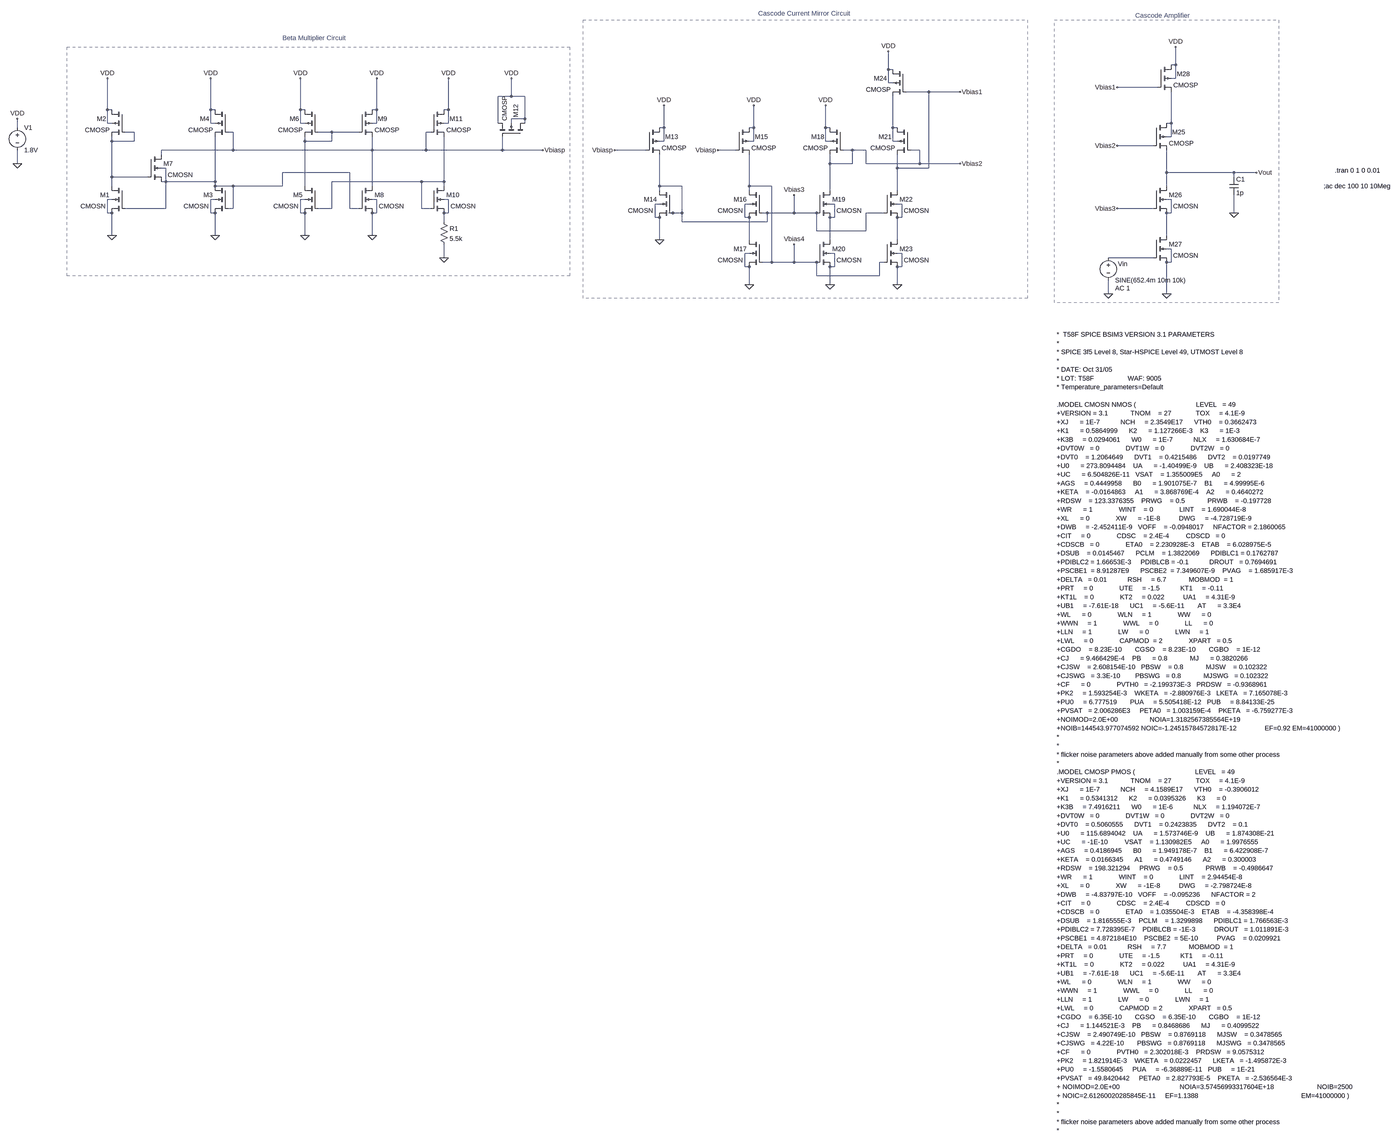
[diagram p0: schematic Rohan Nijhawan_180nm.asc, whole sheet]
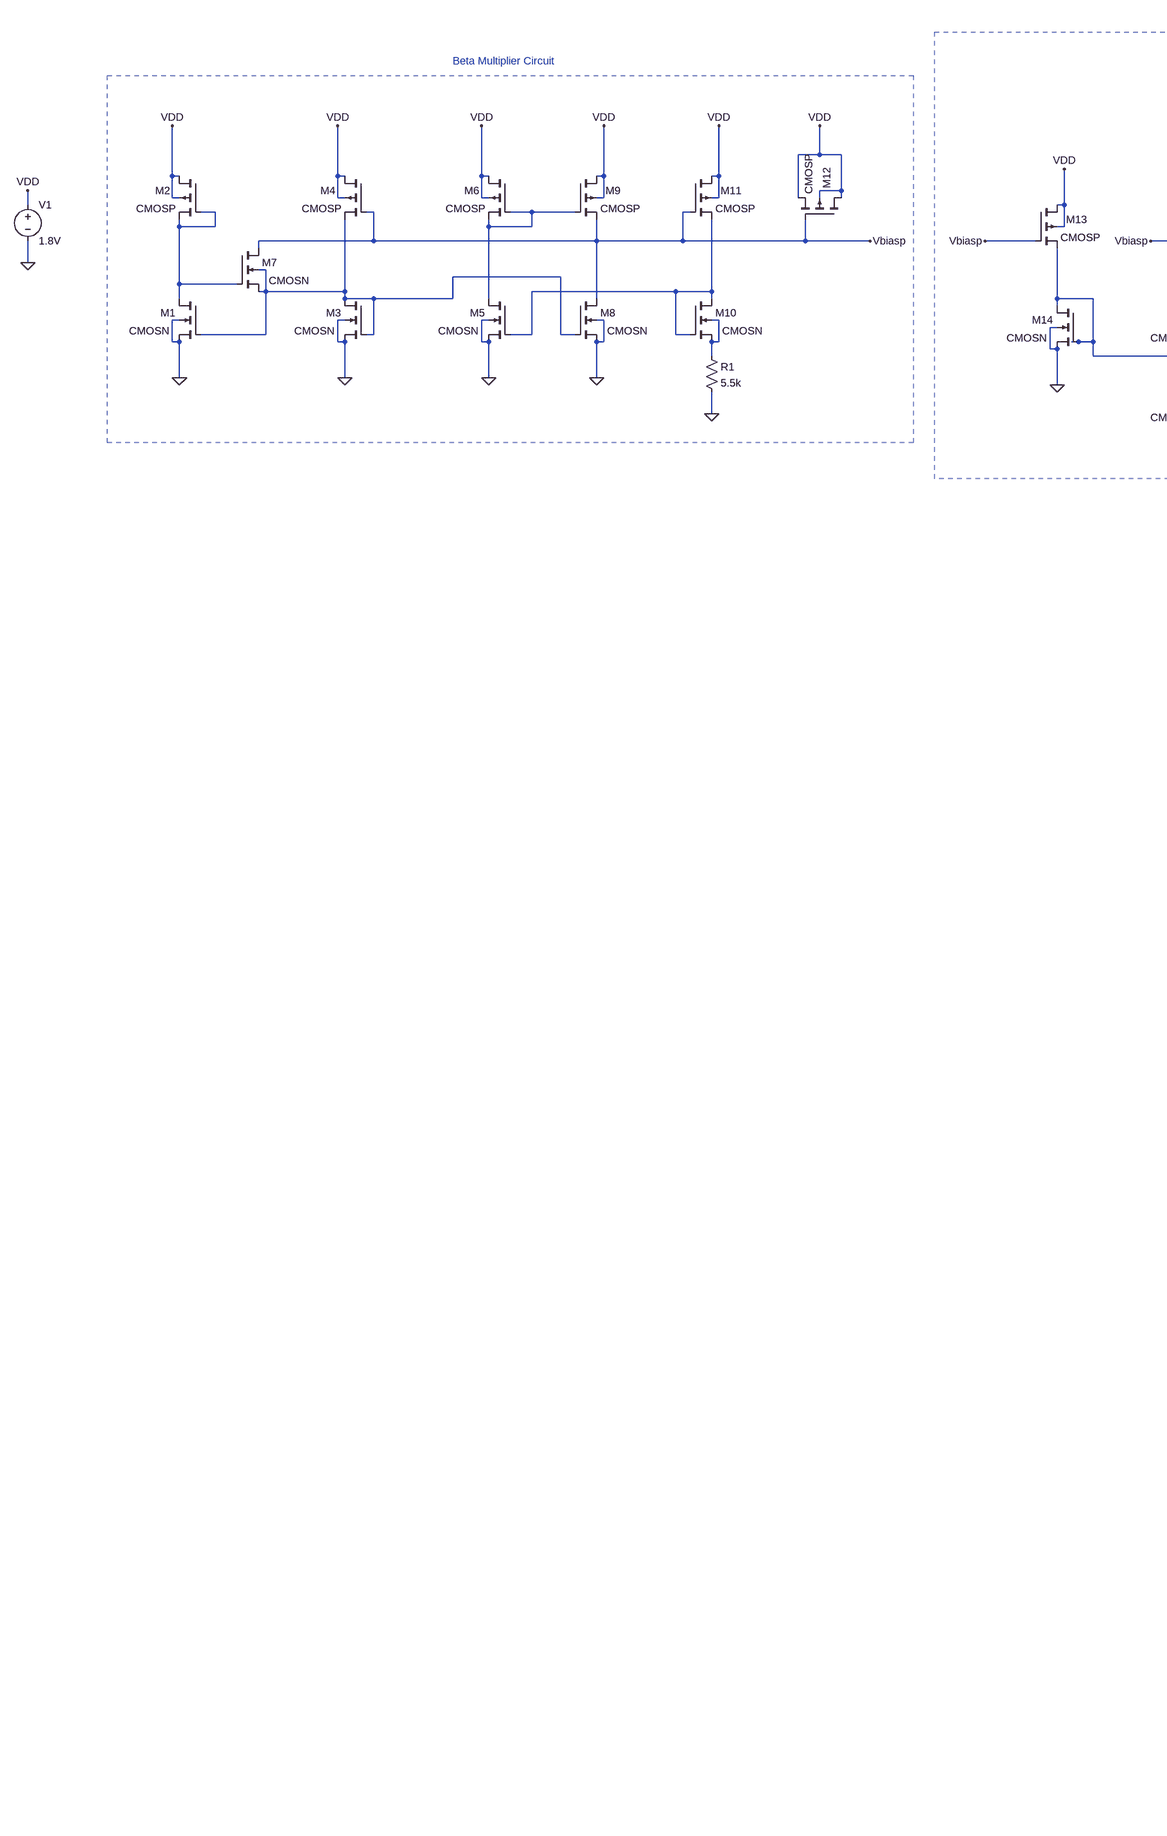
[diagram p1: schematic Rohan Nijhawan_180nm.asc, part, row 1 of 1, column 1 of 2]
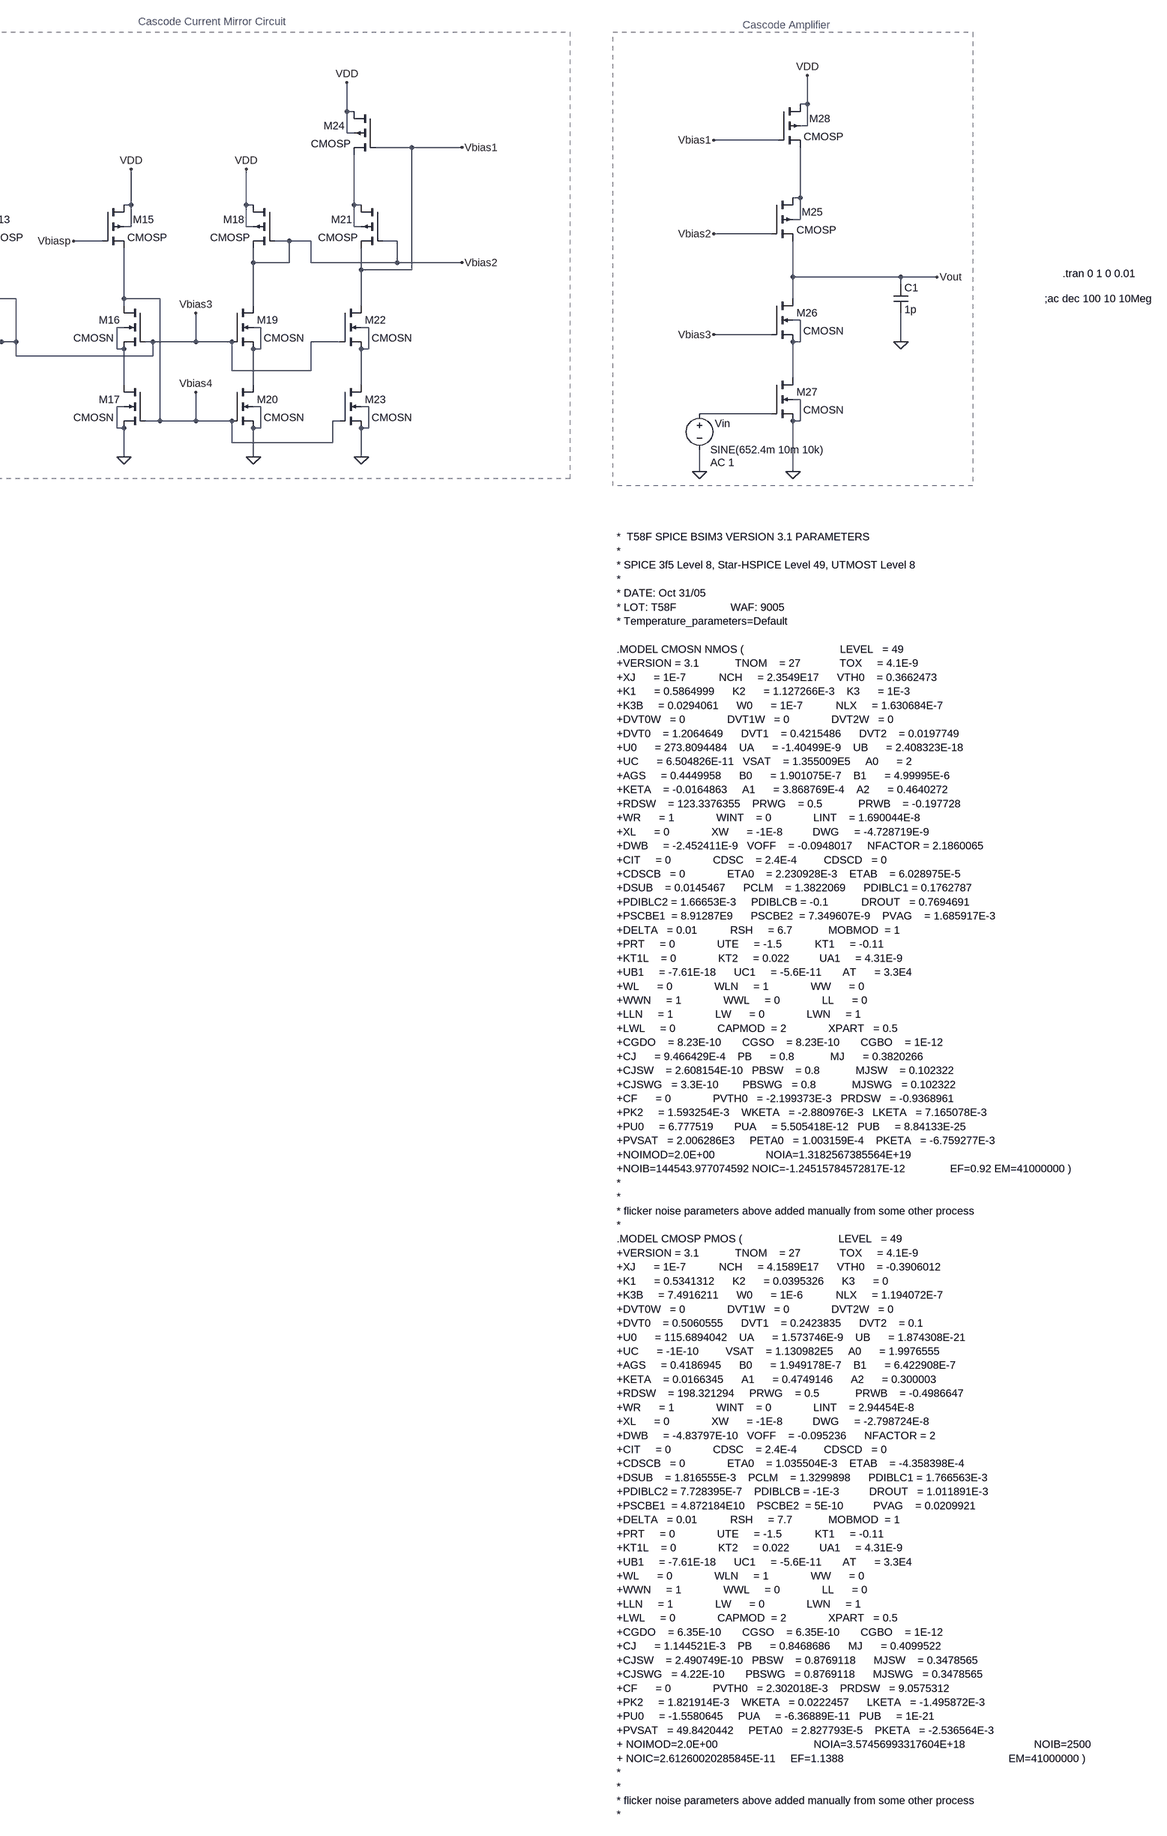
[diagram p2: schematic Rohan Nijhawan_180nm.asc, part, row 1 of 1, column 2 of 2]
Rohan Nijhawan_180nm.asc, the LTspice schematic file:
Version 4
SHEET 1 4864 3636
WIRE 4080 32 4080 -32
WIRE 4080 32 4064 32
WIRE 3056 48 3056 -16
WIRE 3072 48 3056 48
WIRE 4080 80 4080 32
WIRE 4080 80 4064 80
WIRE 3056 96 3056 48
WIRE 3072 96 3056 96
WIRE 4016 112 3872 112
WIRE 3200 128 3120 128
WIRE 3312 128 3200 128
WIRE 1712 144 1712 80
WIRE 1712 144 1664 144
WIRE 1760 144 1712 144
WIRE 272 192 272 80
WIRE 288 192 272 192
WIRE 640 192 640 80
WIRE 656 192 640 192
WIRE 960 192 960 80
WIRE 976 192 960 192
WIRE 1232 192 1232 80
WIRE 1232 192 1216 192
WIRE 1488 192 1488 80
WIRE 1488 192 1472 192
WIRE 1760 224 1760 144
WIRE 1760 224 1712 224
WIRE 272 240 272 192
WIRE 288 240 272 240
WIRE 640 240 640 192
WIRE 656 240 640 240
WIRE 960 240 960 192
WIRE 976 240 960 240
WIRE 1232 240 1232 192
WIRE 1232 240 1216 240
WIRE 1488 240 1488 192
WIRE 1488 240 1472 240
WIRE 1664 240 1664 144
WIRE 1712 240 1712 224
WIRE 1760 240 1760 224
WIRE 4064 240 4064 128
WIRE 4064 240 4048 240
WIRE -144 256 -144 224
WIRE 2256 256 2256 176
WIRE 2256 256 2240 256
WIRE 2576 256 2576 176
WIRE 2576 256 2560 256
WIRE 2832 256 2832 176
WIRE 2848 256 2832 256
WIRE 3072 256 3072 144
WIRE 3088 256 3072 256
WIRE 368 272 336 272
WIRE 720 272 704 272
WIRE 1072 272 1024 272
WIRE 1168 272 1072 272
WIRE 1424 272 1408 272
WIRE 4064 288 4064 240
WIRE 4064 288 4048 288
WIRE 288 304 288 288
WIRE 368 304 368 272
WIRE 368 304 288 304
WIRE 976 304 976 288
WIRE 1072 304 1072 272
WIRE 1072 304 976 304
WIRE 2256 304 2256 256
WIRE 2256 304 2240 304
WIRE 2576 304 2576 256
WIRE 2576 304 2560 304
WIRE 2832 304 2832 256
WIRE 2848 304 2832 304
WIRE 3072 304 3072 256
WIRE 3088 304 3072 304
WIRE 4000 320 3872 320
WIRE 720 336 720 272
WIRE 720 336 464 336
WIRE 1216 336 1216 288
WIRE 1216 336 720 336
WIRE 1408 336 1408 272
WIRE 1408 336 1216 336
WIRE 1680 336 1680 288
WIRE 1680 336 1408 336
WIRE 1824 336 1680 336
WIRE 2192 336 2080 336
WIRE 2512 336 2448 336
WIRE 2928 336 2896 336
WIRE 2976 336 2928 336
WIRE 3168 336 3136 336
WIRE 464 352 464 336
WIRE -144 384 -144 336
WIRE 2848 384 2848 352
WIRE 2928 384 2928 336
WIRE 2928 384 2848 384
WIRE 2976 384 2976 336
WIRE 3168 384 3168 336
WIRE 3168 384 2976 384
WIRE 3312 384 3168 384
WIRE 480 400 464 400
WIRE 3088 400 3088 352
WIRE 3200 400 3200 128
WIRE 3200 400 3088 400
WIRE 1136 416 896 416
WIRE 4048 416 4048 336
WIRE 4288 416 4048 416
WIRE 4368 416 4288 416
WIRE 288 432 288 304
WIRE 416 432 288 432
WIRE 4288 432 4288 416
WIRE 480 448 480 400
WIRE 480 448 464 448
WIRE 656 448 656 288
WIRE 656 448 480 448
WIRE 1392 448 1072 448
WIRE 1472 448 1472 288
WIRE 1472 448 1392 448
WIRE 288 464 288 432
WIRE 656 464 656 448
WIRE 720 464 656 464
WIRE 896 464 896 416
WIRE 896 464 720 464
WIRE 976 464 976 304
WIRE 1216 464 1216 336
WIRE 1472 464 1472 448
WIRE 2240 464 2240 352
WIRE 2320 464 2240 464
WIRE 2560 464 2560 352
WIRE 2640 464 2560 464
WIRE 4048 464 4048 416
WIRE 2240 480 2240 464
WIRE 2560 480 2560 464
WIRE 2848 480 2848 384
WIRE 3088 480 3088 400
WIRE 288 512 272 512
WIRE 656 512 640 512
WIRE 976 512 960 512
WIRE 1232 512 1216 512
WIRE 1488 512 1472 512
WIRE 4064 512 4048 512
WIRE 2240 528 2224 528
WIRE 2560 528 2544 528
WIRE 2864 528 2848 528
WIRE 3104 528 3088 528
WIRE 480 544 480 448
WIRE 480 544 336 544
WIRE 720 544 720 464
WIRE 720 544 704 544
WIRE 1072 544 1072 448
WIRE 1072 544 1024 544
WIRE 1136 544 1136 416
WIRE 1168 544 1136 544
WIRE 1392 544 1392 448
WIRE 1424 544 1392 544
WIRE 4000 544 3872 544
WIRE 272 560 272 512
WIRE 288 560 272 560
WIRE 640 560 640 512
WIRE 656 560 640 560
WIRE 960 560 960 512
WIRE 976 560 960 560
WIRE 1232 560 1232 512
WIRE 1232 560 1216 560
WIRE 1488 560 1488 512
WIRE 1488 560 1472 560
WIRE 2288 560 2272 560
WIRE 2320 560 2320 464
WIRE 2320 560 2288 560
WIRE 2624 560 2608 560
WIRE 2720 560 2720 496
WIRE 2720 560 2624 560
WIRE 2800 560 2720 560
WIRE 3040 560 2976 560
WIRE 4064 560 4064 512
WIRE 4064 560 4048 560
WIRE 4288 560 4288 496
WIRE 2224 576 2224 528
WIRE 2240 576 2224 576
WIRE 2544 576 2544 528
WIRE 2560 576 2544 576
WIRE 2864 576 2864 528
WIRE 2864 576 2848 576
WIRE 3104 576 3104 528
WIRE 3104 576 3088 576
WIRE 1472 592 1472 560
WIRE 2320 592 2320 560
WIRE 2624 592 2624 560
WIRE 2624 592 2320 592
WIRE 2800 624 2800 560
WIRE 2976 624 2976 560
WIRE 2976 624 2800 624
WIRE 288 640 288 560
WIRE 656 640 656 560
WIRE 976 640 976 560
WIRE 1216 640 1216 560
WIRE 4048 640 4048 560
WIRE 2240 656 2240 576
WIRE 2560 656 2560 576
WIRE 2848 656 2848 576
WIRE 3088 656 3088 576
WIRE 4064 688 4048 688
WIRE 2560 704 2544 704
WIRE 2864 704 2848 704
WIRE 3104 704 3088 704
WIRE 1472 720 1472 672
WIRE 4000 720 3840 720
WIRE 2640 736 2640 464
WIRE 2640 736 2608 736
WIRE 2720 736 2720 672
WIRE 2720 736 2640 736
WIRE 2800 736 2720 736
WIRE 3040 736 3024 736
WIRE 4064 736 4064 688
WIRE 4064 736 4048 736
WIRE 2544 752 2544 704
WIRE 2560 752 2544 752
WIRE 2864 752 2864 704
WIRE 2864 752 2848 752
WIRE 3104 752 3104 704
WIRE 3104 752 3088 752
WIRE 2800 784 2800 736
WIRE 3024 784 3024 736
WIRE 3024 784 2800 784
WIRE 2560 816 2560 752
WIRE 2848 816 2848 752
WIRE 3088 816 3088 752
WIRE 3840 848 3840 800
WIRE 4048 848 4048 736
FLAG -144 384 0
FLAG -144 224 VDD
FLAG 272 80 VDD
FLAG 288 640 0
FLAG 640 80 VDD
FLAG 656 640 0
FLAG 960 80 VDD
FLAG 976 640 0
FLAG 1232 80 VDD
FLAG 1216 640 0
FLAG 1488 80 VDD
FLAG 1472 720 0
FLAG 1712 80 VDD
FLAG 1824 336 Vbiasp
FLAG 2080 336 Vbiasp
FLAG 2240 656 0
FLAG 2256 176 VDD
FLAG 2576 176 VDD
FLAG 2448 336 Vbiasp
FLAG 2560 816 0
FLAG 2832 176 VDD
FLAG 2848 816 0
FLAG 3056 -16 VDD
FLAG 3088 816 0
FLAG 3312 128 Vbias1
FLAG 3312 384 Vbias2
FLAG 2720 496 Vbias3
FLAG 2720 672 Vbias4
FLAG 4048 848 0
FLAG 3872 112 Vbias1
FLAG 3872 320 Vbias2
FLAG 3872 544 Vbias3
FLAG 3840 848 0
FLAG 4288 560 0
FLAG 4368 416 Vout
FLAG 4080 -32 VDD
SYMBOL voltage -144 240 R0
WINDOW 123 0 0 Left 0
WINDOW 39 0 0 Left 0
SYMATTR InstName V1
SYMATTR Value 1.8V
SYMBOL nmos4 336 464 M0
WINDOW 3 71 72 Left 2
SYMATTR Value CMOSN
SYMATTR InstName M1
SYMATTR Value2 l=360n w=1800n
SYMBOL pmos4 336 192 M0
WINDOW 0 68 32 Left 2
SYMATTR InstName M2
SYMATTR Value CMOSP
SYMATTR Value2 l=3600n w=1800n
SYMBOL nmos4 704 464 M0
WINDOW 3 71 72 Left 2
SYMATTR Value CMOSN
SYMATTR InstName M3
SYMATTR Value2 l=360n w=1800n
SYMBOL pmos4 704 192 M0
WINDOW 0 68 32 Left 2
SYMATTR InstName M4
SYMATTR Value CMOSP
SYMATTR Value2 l=360n w=4320n
SYMBOL nmos4 1024 464 M0
WINDOW 3 71 72 Left 2
SYMATTR Value CMOSN
SYMATTR InstName M5
SYMATTR Value2 l=360n w=1800n
SYMBOL pmos4 1024 192 M0
WINDOW 0 68 32 Left 2
SYMATTR InstName M6
SYMATTR Value CMOSP
SYMATTR Value2 l=360n w=4320n
SYMBOL nmos4 416 352 R0
WINDOW 3 71 72 Left 2
SYMATTR Value CMOSN
SYMATTR InstName M7
SYMATTR Value2 l=360n w=720n
SYMBOL nmos4 1168 464 R0
WINDOW 3 71 72 Left 2
SYMATTR Value CMOSN
SYMATTR InstName M8
SYMATTR Value2 l=360n w=1800n
SYMBOL pmos4 1168 192 R0
WINDOW 0 68 32 Left 2
SYMATTR InstName M9
SYMATTR Value CMOSP
SYMATTR Value2 l=360n w=4320n
SYMBOL nmos4 1424 464 R0
WINDOW 3 71 72 Left 2
SYMATTR Value CMOSN
SYMATTR InstName M10
SYMATTR Value2 l=360n w=5400n
SYMBOL pmos4 1424 192 R0
WINDOW 0 68 32 Left 2
SYMATTR InstName M11
SYMATTR Value CMOSP
SYMATTR Value2 l=360n w=4320n
SYMBOL res 1456 576 R0
SYMATTR InstName R1
SYMATTR Value 5.5k
SYMBOL pmos4 1760 288 M270
WINDOW 0 68 32 Left 2
SYMATTR InstName M12
SYMATTR Value CMOSP
SYMATTR Value2 l=9u w=9u
SYMBOL pmos4 2192 256 R0
WINDOW 0 68 32 Left 2
SYMATTR InstName M13
SYMATTR Value CMOSP
SYMATTR Value2 l=360n w=4320n
SYMBOL nmos4 2288 480 M0
WINDOW 3 71 72 Left 2
SYMATTR Value CMOSN
SYMATTR InstName M14
SYMATTR Value2 l=360n w=900n
SYMBOL pmos4 2512 256 R0
WINDOW 0 68 32 Left 2
SYMATTR InstName M15
SYMATTR Value CMOSP
SYMATTR Value2 l=360n w=4320n
SYMBOL nmos4 2608 480 M0
WINDOW 3 71 72 Left 2
SYMATTR Value CMOSN
SYMATTR InstName M16
SYMATTR Value2 l=360n w=1800n
SYMBOL nmos4 2608 656 M0
WINDOW 3 71 72 Left 2
SYMATTR Value CMOSN
SYMATTR InstName M17
SYMATTR Value2 l=360n w=1800n
SYMBOL pmos4 2896 256 M0
WINDOW 0 68 32 Left 2
SYMATTR InstName M18
SYMATTR Value CMOSP
SYMATTR Value2 l=900n w=3600n
SYMBOL nmos4 2800 480 R0
WINDOW 3 71 72 Left 2
SYMATTR Value CMOSN
SYMATTR InstName M19
SYMATTR Value2 l=360n w=1800n
SYMBOL nmos4 2800 656 R0
WINDOW 3 71 72 Left 2
SYMATTR Value CMOSN
SYMATTR InstName M20
SYMATTR Value2 l=360n w=1800n
SYMBOL pmos4 3136 256 M0
WINDOW 0 68 32 Left 2
SYMATTR InstName M21
SYMATTR Value CMOSP
SYMATTR Value2 l=360n w=4320n
SYMBOL nmos4 3040 480 R0
WINDOW 3 71 72 Left 2
SYMATTR Value CMOSN
SYMATTR InstName M22
SYMATTR Value2 l=360n w=1800n
SYMBOL nmos4 3040 656 R0
WINDOW 3 71 72 Left 2
SYMATTR Value CMOSN
SYMATTR InstName M23
SYMATTR Value2 l=360n w=1800n
SYMBOL pmos4 3120 48 M0
WINDOW 0 68 32 Left 2
SYMATTR InstName M24
SYMATTR Value CMOSP
SYMATTR Value2 l=360n w=4320n
SYMBOL pmos4 4000 240 R0
WINDOW 0 68 32 Left 2
SYMATTR InstName M25
SYMATTR Value CMOSP
SYMATTR Value2 l=360n w=3960n
SYMBOL nmos4 4000 464 R0
WINDOW 3 71 72 Left 2
SYMATTR Value CMOSN
SYMATTR InstName M26
SYMATTR Value2 l=360n w=1800n
SYMBOL nmos4 4000 640 R0
WINDOW 3 71 72 Left 2
SYMATTR Value CMOSN
SYMATTR InstName M27
SYMATTR Value2 l=360n w=1800n
SYMBOL pmos4 4016 32 R0
WINDOW 0 68 32 Left 2
SYMATTR InstName M28
SYMATTR Value CMOSP
SYMATTR Value2 l=360n w=3960n
SYMBOL voltage 3840 704 R0
WINDOW 0 34 38 Left 2
WINDOW 123 24 124 Left 2
WINDOW 39 0 0 Left 0
SYMATTR InstName Vin
SYMATTR Value2 AC 1
SYMATTR Value SINE(652.4m 10m 10k)
SYMBOL cap 4272 432 R0
SYMATTR InstName C1
SYMATTR Value 1p
TEXT 896 -64 Left 2 ;Beta Multiplier Circuit
TEXT 2592 -152 Left 2 ;Cascode Current Mirror Circuit
TEXT 3936 -144 Left 2 ;Cascode Amplifier
TEXT 4608 464 Left 2 !;ac dec 100 10 10Meg
TEXT 3656 1072 Left 2 !*  T58F SPICE BSIM3 VERSION 3.1 PARAMETERS\n* \n* SPICE 3f5 Level 8, Star-HSPICE Level 49, UTMOST Level 8\n* \n* DATE: Oct 31/05\n* LOT: T58F                  WAF: 9005\n* Temperature_parameters=Default\n \n.MODEL CMOSN NMOS (                                LEVEL   = 49\n+VERSION = 3.1            TNOM    = 27             TOX     = 4.1E-9\n+XJ      = 1E-7           NCH     = 2.3549E17      VTH0    = 0.3662473\n+K1      = 0.5864999      K2      = 1.127266E-3    K3      = 1E-3\n+K3B     = 0.0294061      W0      = 1E-7           NLX     = 1.630684E-7\n+DVT0W   = 0              DVT1W   = 0              DVT2W   = 0\n+DVT0    = 1.2064649      DVT1    = 0.4215486      DVT2    = 0.0197749\n+U0      = 273.8094484    UA      = -1.40499E-9    UB      = 2.408323E-18\n+UC      = 6.504826E-11   VSAT    = 1.355009E5     A0      = 2\n+AGS     = 0.4449958      B0      = 1.901075E-7    B1      = 4.99995E-6\n+KETA    = -0.0164863     A1      = 3.868769E-4    A2      = 0.4640272\n+RDSW    = 123.3376355    PRWG    = 0.5            PRWB    = -0.197728\n+WR      = 1              WINT    = 0              LINT    = 1.690044E-8\n+XL      = 0              XW      = -1E-8          DWG     = -4.728719E-9\n+DWB     = -2.452411E-9   VOFF    = -0.0948017     NFACTOR = 2.1860065\n+CIT     = 0              CDSC    = 2.4E-4         CDSCD   = 0\n+CDSCB   = 0              ETA0    = 2.230928E-3    ETAB    = 6.028975E-5\n+DSUB    = 0.0145467      PCLM    = 1.3822069      PDIBLC1 = 0.1762787\n+PDIBLC2 = 1.66653E-3     PDIBLCB = -0.1           DROUT   = 0.7694691\n+PSCBE1  = 8.91287E9      PSCBE2  = 7.349607E-9    PVAG    = 1.685917E-3\n+DELTA   = 0.01           RSH     = 6.7            MOBMOD  = 1\n+PRT     = 0              UTE     = -1.5           KT1     = -0.11\n+KT1L    = 0              KT2     = 0.022          UA1     = 4.31E-9\n+UB1     = -7.61E-18      UC1     = -5.6E-11       AT      = 3.3E4\n+WL      = 0              WLN     = 1              WW      = 0\n+WWN     = 1              WWL     = 0              LL      = 0\n+LLN     = 1              LW      = 0              LWN     = 1\n+LWL     = 0              CAPMOD  = 2              XPART   = 0.5\n+CGDO    = 8.23E-10       CGSO    = 8.23E-10       CGBO    = 1E-12\n+CJ      = 9.466429E-4    PB      = 0.8            MJ      = 0.3820266\n+CJSW    = 2.608154E-10   PBSW    = 0.8            MJSW    = 0.102322\n+CJSWG   = 3.3E-10        PBSWG   = 0.8            MJSWG   = 0.102322\n+CF      = 0              PVTH0   = -2.199373E-3   PRDSW   = -0.9368961\n+PK2     = 1.593254E-3    WKETA   = -2.880976E-3   LKETA   = 7.165078E-3\n+PU0     = 6.777519       PUA     = 5.505418E-12   PUB     = 8.84133E-25\n+PVSAT   = 2.006286E3     PETA0   = 1.003159E-4    PKETA   = -6.759277E-3\n+NOIMOD=2.0E+00                 NOIA=1.3182567385564E+19\n+NOIB=144543.977074592 NOIC=-1.24515784572817E-12               EF=0.92 EM=41000000 )\n*\n*\n* flicker noise parameters above added manually from some other process\n* \n.MODEL CMOSP PMOS (                                LEVEL   = 49\n+VERSION = 3.1            TNOM    = 27             TOX     = 4.1E-9\n+XJ      = 1E-7           NCH     = 4.1589E17      VTH0    = -0.3906012\n+K1      = 0.5341312      K2      = 0.0395326      K3      = 0\n+K3B     = 7.4916211      W0      = 1E-6           NLX     = 1.194072E-7\n+DVT0W   = 0              DVT1W   = 0              DVT2W   = 0\n+DVT0    = 0.5060555      DVT1    = 0.2423835      DVT2    = 0.1\n+U0      = 115.6894042    UA      = 1.573746E-9    UB      = 1.874308E-21\n+UC      = -1E-10         VSAT    = 1.130982E5     A0      = 1.9976555\n+AGS     = 0.4186945      B0      = 1.949178E-7    B1      = 6.422908E-7\n+KETA    = 0.0166345      A1      = 0.4749146      A2      = 0.300003\n+RDSW    = 198.321294     PRWG    = 0.5            PRWB    = -0.4986647\n+WR      = 1              WINT    = 0              LINT    = 2.94454E-8\n+XL      = 0              XW      = -1E-8          DWG     = -2.798724E-8\n+DWB     = -4.83797E-10   VOFF    = -0.095236      NFACTOR = 2\n+CIT     = 0              CDSC    = 2.4E-4         CDSCD   = 0\n+CDSCB   = 0              ETA0    = 1.035504E-3    ETAB    = -4.358398E-4\n+DSUB    = 1.816555E-3    PCLM    = 1.3299898      PDIBLC1 = 1.766563E-3\n+PDIBLC2 = 7.728395E-7    PDIBLCB = -1E-3          DROUT   = 1.011891E-3\n+PSCBE1  = 4.872184E10    PSCBE2  = 5E-10          PVAG    = 0.0209921\n+DELTA   = 0.01           RSH     = 7.7            MOBMOD  = 1\n+PRT     = 0              UTE     = -1.5           KT1     = -0.11\n+KT1L    = 0              KT2     = 0.022          UA1     = 4.31E-9\n+UB1     = -7.61E-18      UC1     = -5.6E-11       AT      = 3.3E4\n+WL      = 0              WLN     = 1              WW      = 0\n+WWN     = 1              WWL     = 0              LL      = 0\n+LLN     = 1              LW      = 0              LWN     = 1\n+LWL     = 0              CAPMOD  = 2              XPART   = 0.5\n+CGDO    = 6.35E-10       CGSO    = 6.35E-10       CGBO    = 1E-12\n+CJ      = 1.144521E-3    PB      = 0.8468686      MJ      = 0.4099522\n+CJSW    = 2.490749E-10   PBSW    = 0.8769118      MJSW    = 0.3478565\n+CJSWG   = 4.22E-10       PBSWG   = 0.8769118      MJSWG   = 0.3478565\n+CF      = 0              PVTH0   = 2.302018E-3    PRDSW   = 9.0575312\n+PK2     = 1.821914E-3    WKETA   = 0.0222457      LKETA   = -1.495872E-3\n+PU0     = -1.5580645     PUA     = -6.36889E-11   PUB     = 1E-21\n+PVSAT   = 49.8420442     PETA0   = 2.827793E-5    PKETA   = -2.536564E-3 \n+ NOIMOD=2.0E+00                                NOIA=3.57456993317604E+18                       NOIB=2500\n+ NOIC=2.61260020285845E-11     EF=1.1388                                                       EM=41000000 )\n*\n*\n* flicker noise parameters above added manually from some other process\n*
TEXT 4648 408 Left 2 !.tran 0 1 0 0.01
RECTANGLE Normal 1920 784 128 -32 2
RECTANGLE Normal 3552 864 1968 -128 2
RECTANGLE Normal 4448 880 3648 -128 2

The netlist it stands for:
* Rohan Nijhawan_180nm.asc
V1 VDD 0 1.8V
M1 N003 N005 0 0 CMOSN l=360n w=1800n
M2 VDD N003 N003 VDD CMOSP l=3600n w=1800n
M3 N005 N005 0 0 CMOSN l=360n w=1800n
M4 VDD Vbiasp N005 VDD CMOSP l=360n w=4320n
M5 N004 N006 0 0 CMOSN l=360n w=1800n
M6 VDD N004 N004 VDD CMOSP l=360n w=4320n
M7 Vbiasp N003 N005 N005 CMOSN l=360n w=720n
M8 Vbiasp N005 0 0 CMOSN l=360n w=1800n
M9 VDD N004 Vbiasp VDD CMOSP l=360n w=4320n
M10 N006 N006 N007 N007 CMOSN l=360n w=5400n
M11 VDD Vbiasp N006 VDD CMOSP l=360n w=4320n
R1 N007 0 5.5k
M12 VDD Vbiasp VDD VDD CMOSP l=9u w=9u
M13 VDD Vbiasp Vbias3 VDD CMOSP l=360n w=4320n
M14 Vbias3 Vbias3 0 0 CMOSN l=360n w=900n
M15 VDD Vbiasp Vbias4 VDD CMOSP l=360n w=4320n
M16 Vbias4 Vbias3 N009 N009 CMOSN l=360n w=1800n
M17 N009 Vbias4 0 0 CMOSN l=360n w=1800n
M18 VDD Vbias2 Vbias2 VDD CMOSP l=900n w=3600n
M19 Vbias2 Vbias3 N010 N010 CMOSN l=360n w=1800n
M20 N010 Vbias4 0 0 CMOSN l=360n w=1800n
M21 N002 Vbias2 Vbias1 N002 CMOSP l=360n w=4320n
M22 Vbias1 Vbias3 N011 N011 CMOSN l=360n w=1800n
M23 N011 Vbias4 0 0 CMOSN l=360n w=1800n
M24 VDD Vbias1 N002 VDD CMOSP l=360n w=4320n
M25 N001 Vbias2 Vout N001 CMOSP l=360n w=3960n
M26 Vout Vbias3 N008 N008 CMOSN l=360n w=1800n
M27 N008 N012 0 0 CMOSN l=360n w=1800n
M28 VDD Vbias1 N001 VDD CMOSP l=360n w=3960n
Vin N012 0 SINE(652.4m 10m 10k) AC 1
C1 Vout 0 1p
.model NMOS NMOS
.model PMOS PMOS
.lib standard.mos
* Beta Multiplier Circuit
* Cascode Current Mirror Circuit
* Cascode Amplifier
;ac dec 100 10 10Meg
*  T58F SPICE BSIM3 VERSION 3.1 PARAMETERS
*
* SPICE 3f5 Level 8, Star-HSPICE Level 49, UTMOST Level 8
*
* DATE: Oct 31/05
* LOT: T58F                  WAF: 9005
* Temperature_parameters=Default
.MODEL CMOSN NMOS (                                LEVEL   = 49
+VERSION = 3.1            TNOM    = 27             TOX     = 4.1E-9
+XJ      = 1E-7           NCH     = 2.3549E17      VTH0    = 0.3662473
+K1      = 0.5864999      K2      = 1.127266E-3    K3      = 1E-3
+K3B     = 0.0294061      W0      = 1E-7           NLX     = 1.630684E-7
+DVT0W   = 0              DVT1W   = 0              DVT2W   = 0
+DVT0    = 1.2064649      DVT1    = 0.4215486      DVT2    = 0.0197749
+U0      = 273.8094484    UA      = -1.40499E-9    UB      = 2.408323E-18
+UC      = 6.504826E-11   VSAT    = 1.355009E5     A0      = 2
+AGS     = 0.4449958      B0      = 1.901075E-7    B1      = 4.99995E-6
+KETA    = -0.0164863     A1      = 3.868769E-4    A2      = 0.4640272
+RDSW    = 123.3376355    PRWG    = 0.5            PRWB    = -0.197728
+WR      = 1              WINT    = 0              LINT    = 1.690044E-8
+XL      = 0              XW      = -1E-8          DWG     = -4.728719E-9
+DWB     = -2.452411E-9   VOFF    = -0.0948017     NFACTOR = 2.1860065
+CIT     = 0              CDSC    = 2.4E-4         CDSCD   = 0
+CDSCB   = 0              ETA0    = 2.230928E-3    ETAB    = 6.028975E-5
+DSUB    = 0.0145467      PCLM    = 1.3822069      PDIBLC1 = 0.1762787
+PDIBLC2 = 1.66653E-3     PDIBLCB = -0.1           DROUT   = 0.7694691
+PSCBE1  = 8.91287E9      PSCBE2  = 7.349607E-9    PVAG    = 1.685917E-3
+DELTA   = 0.01           RSH     = 6.7            MOBMOD  = 1
+PRT     = 0              UTE     = -1.5           KT1     = -0.11
+KT1L    = 0              KT2     = 0.022          UA1     = 4.31E-9
+UB1     = -7.61E-18      UC1     = -5.6E-11       AT      = 3.3E4
+WL      = 0              WLN     = 1              WW      = 0
+WWN     = 1              WWL     = 0              LL      = 0
+LLN     = 1              LW      = 0              LWN     = 1
+LWL     = 0              CAPMOD  = 2              XPART   = 0.5
+CGDO    = 8.23E-10       CGSO    = 8.23E-10       CGBO    = 1E-12
+CJ      = 9.466429E-4    PB      = 0.8            MJ      = 0.3820266
+CJSW    = 2.608154E-10   PBSW    = 0.8            MJSW    = 0.102322
+CJSWG   = 3.3E-10        PBSWG   = 0.8            MJSWG   = 0.102322
+CF      = 0              PVTH0   = -2.199373E-3   PRDSW   = -0.9368961
+PK2     = 1.593254E-3    WKETA   = -2.880976E-3   LKETA   = 7.165078E-3
+PU0     = 6.777519       PUA     = 5.505418E-12   PUB     = 8.84133E-25
+PVSAT   = 2.006286E3     PETA0   = 1.003159E-4    PKETA   = -6.759277E-3
+NOIMOD=2.0E+00                 NOIA=1.3182567385564E+19
+NOIB=144543.977074592 NOIC=-1.24515784572817E-12               EF=0.92 EM=41000000 )
*
*
* flicker noise parameters above added manually from some other process
*
.MODEL CMOSP PMOS (                                LEVEL   = 49
+VERSION = 3.1            TNOM    = 27             TOX     = 4.1E-9
+XJ      = 1E-7           NCH     = 4.1589E17      VTH0    = -0.3906012
+K1      = 0.5341312      K2      = 0.0395326      K3      = 0
+K3B     = 7.4916211      W0      = 1E-6           NLX     = 1.194072E-7
+DVT0W   = 0              DVT1W   = 0              DVT2W   = 0
+DVT0    = 0.5060555      DVT1    = 0.2423835      DVT2    = 0.1
+U0      = 115.6894042    UA      = 1.573746E-9    UB      = 1.874308E-21
+UC      = -1E-10         VSAT    = 1.130982E5     A0      = 1.9976555
+AGS     = 0.4186945      B0      = 1.949178E-7    B1      = 6.422908E-7
+KETA    = 0.0166345      A1      = 0.4749146      A2      = 0.300003
+RDSW    = 198.321294     PRWG    = 0.5            PRWB    = -0.4986647
+WR      = 1              WINT    = 0              LINT    = 2.94454E-8
+XL      = 0              XW      = -1E-8          DWG     = -2.798724E-8
+DWB     = -4.83797E-10   VOFF    = -0.095236      NFACTOR = 2
+CIT     = 0              CDSC    = 2.4E-4         CDSCD   = 0
+CDSCB   = 0              ETA0    = 1.035504E-3    ETAB    = -4.358398E-4
+DSUB    = 1.816555E-3    PCLM    = 1.3299898      PDIBLC1 = 1.766563E-3
+PDIBLC2 = 7.728395E-7    PDIBLCB = -1E-3          DROUT   = 1.011891E-3
+PSCBE1  = 4.872184E10    PSCBE2  = 5E-10          PVAG    = 0.0209921
+DELTA   = 0.01           RSH     = 7.7            MOBMOD  = 1
+PRT     = 0              UTE     = -1.5           KT1     = -0.11
+KT1L    = 0              KT2     = 0.022          UA1     = 4.31E-9
+UB1     = -7.61E-18      UC1     = -5.6E-11       AT      = 3.3E4
+WL      = 0              WLN     = 1              WW      = 0
+WWN     = 1              WWL     = 0              LL      = 0
+LLN     = 1              LW      = 0              LWN     = 1
+LWL     = 0              CAPMOD  = 2              XPART   = 0.5
+CGDO    = 6.35E-10       CGSO    = 6.35E-10       CGBO    = 1E-12
+CJ      = 1.144521E-3    PB      = 0.8468686      MJ      = 0.4099522
+CJSW    = 2.490749E-10   PBSW    = 0.8769118      MJSW    = 0.3478565
+CJSWG   = 4.22E-10       PBSWG   = 0.8769118      MJSWG   = 0.3478565
+CF      = 0              PVTH0   = 2.302018E-3    PRDSW   = 9.0575312
+PK2     = 1.821914E-3    WKETA   = 0.0222457      LKETA   = -1.495872E-3
+PU0     = -1.5580645     PUA     = -6.36889E-11   PUB     = 1E-21
+PVSAT   = 49.8420442     PETA0   = 2.827793E-5    PKETA   = -2.536564E-3
+ NOIMOD=2.0E+00                                NOIA=3.57456993317604E+18                       NOIB=2500
+ NOIC=2.61260020285845E-11     EF=1.1388                                                       EM=41000000 )
*
*
* flicker noise parameters above added manually from some other process
*
.tran 0 1 0 0.01
.backanno
.end